# Altium schematic sheet DATN.SchDoc: IOT kit
size A3 portrait; Author: linhcopper@gmail.com
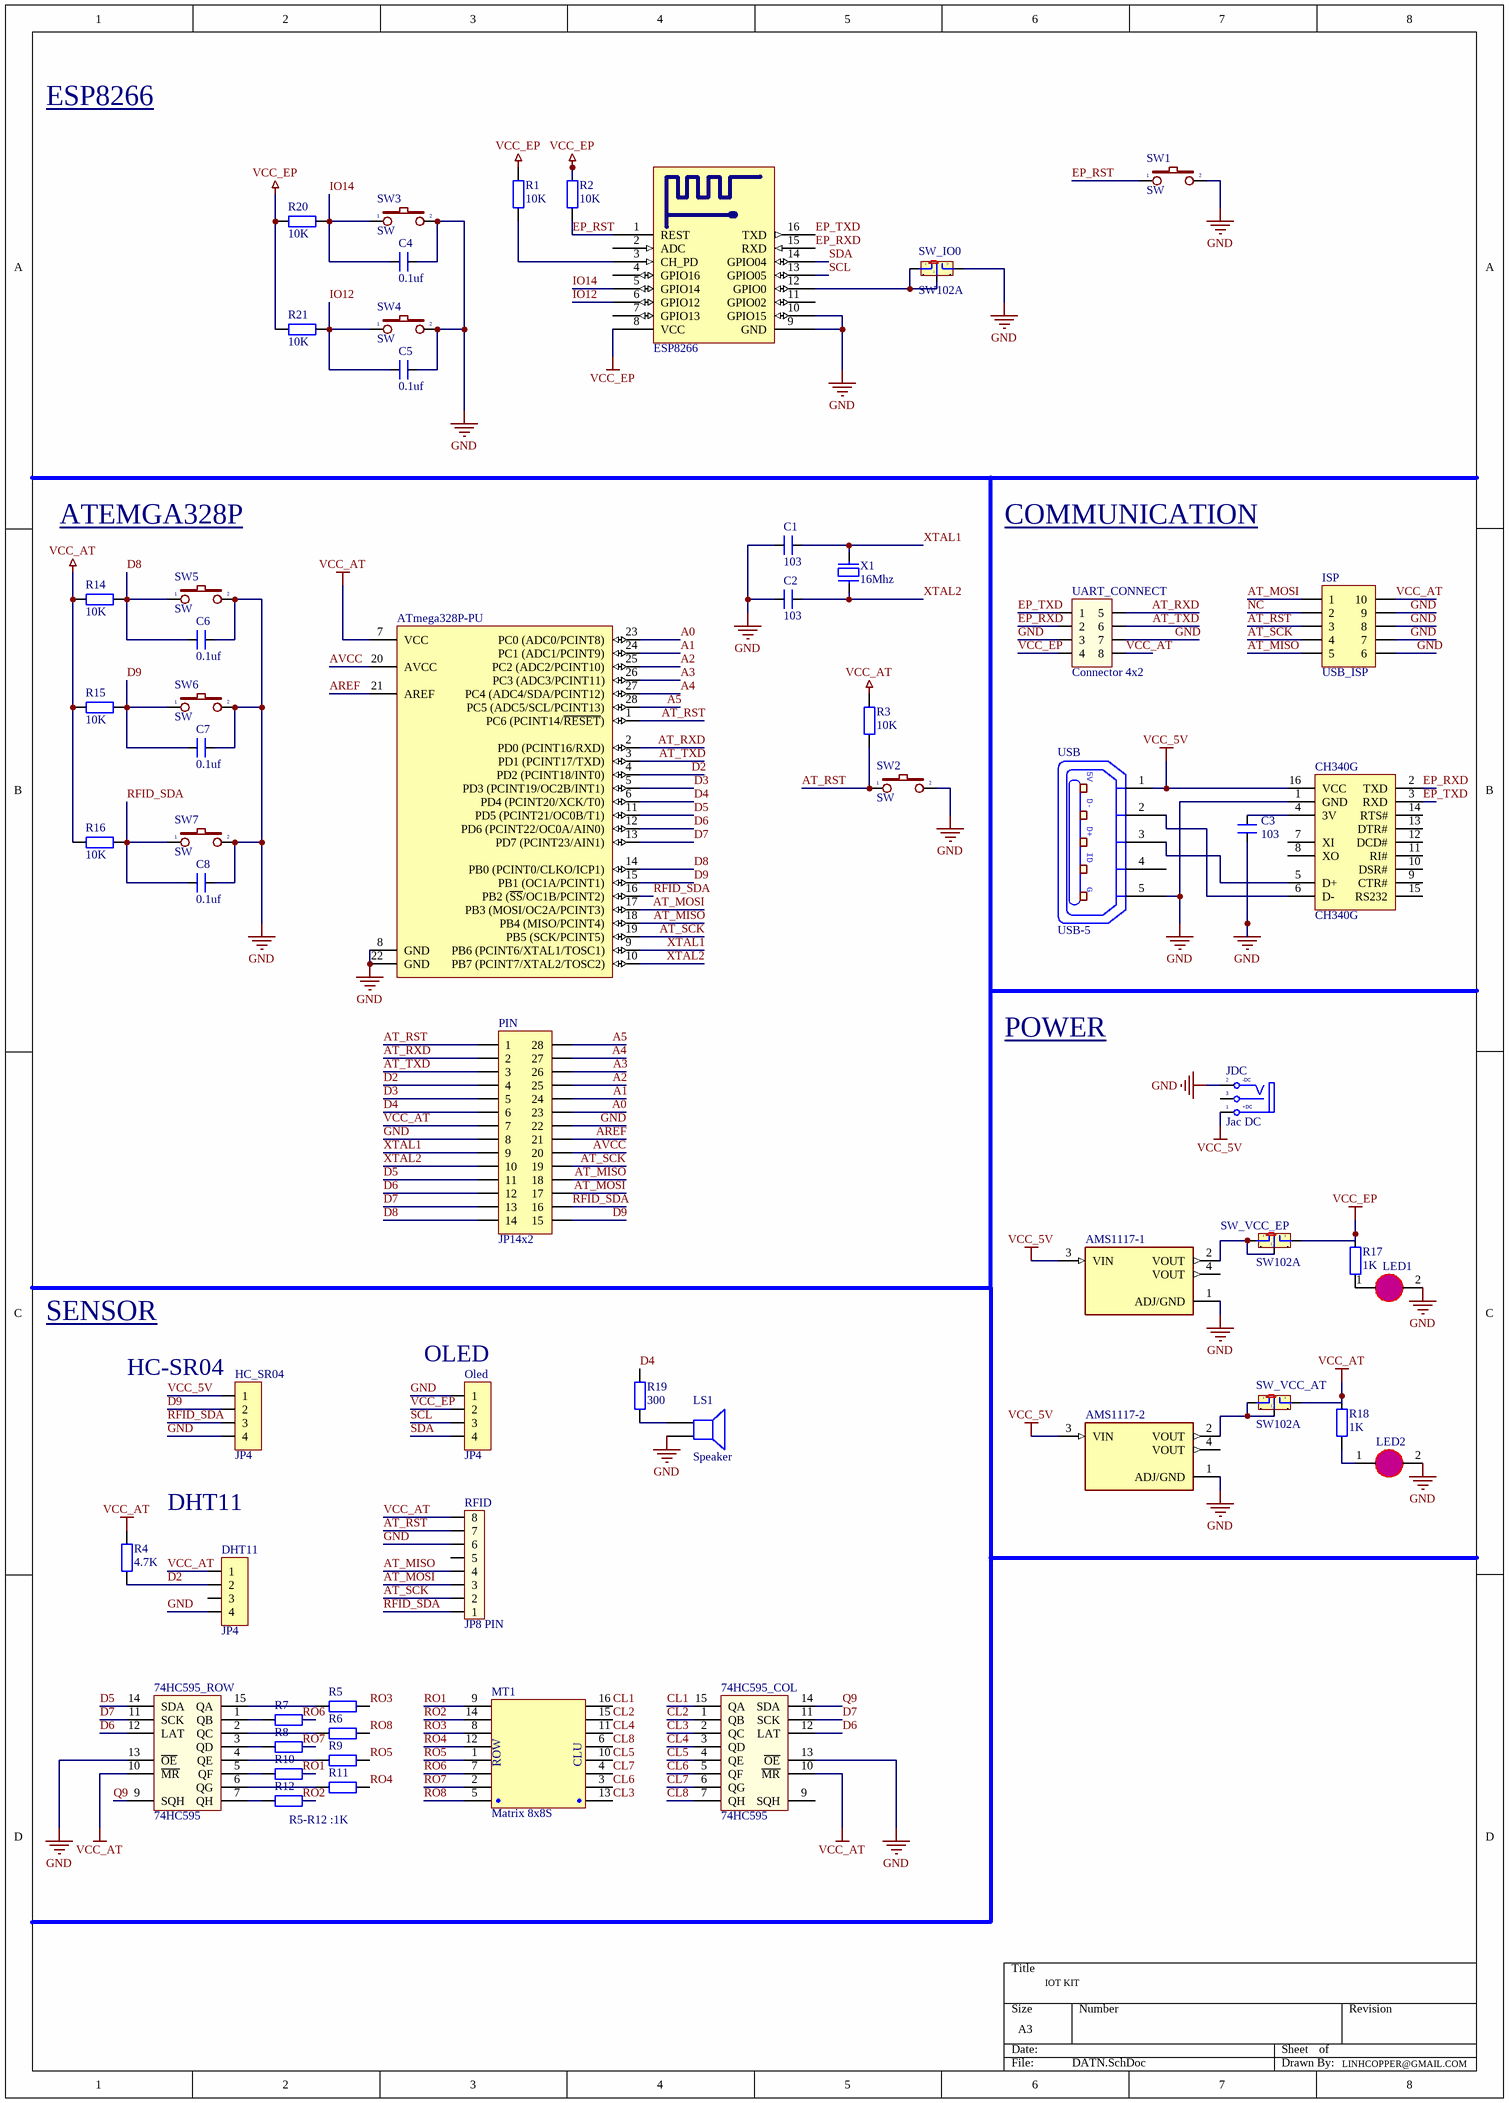
[diagram p0: DATN.SchDoc]

## Parts
74HC595_COL  74HC595  [DIP16/W0.3]
74HC595_ROW  74HC595  [DIP16/W0.3]
AMS1117-1  (no value)  [SOT229P700X180-4N]
AMS1117-2  (no value)  [SOT229P700X180-4N]
ATmega328P-PU  (no value)  [28P3]
C1  103  [SM-0805]
C2  103  [SM-0805]
C3  103  [SM-0805]
C4  0.1uf  [SM-0805]
C5  0.1uf  [SM-0805]
C6  0.1uf  [SM-0805]
C7  0.1uf  [SM-0805]
C8  0.1uf  [SM-0805]
CH340G  CH340G  [SO16]
DHT11  JP4  [JP4 - DHT11]
ESP8266  ESP-12  [ESP_12]  (value not drawn)
HC_SR04  JP4  [JP4 -HC_SR04]
ISP  USB_ISP  [JP5-D2T]
JDC  Jac DC  [DC-IN]
LED1  (no value)  [LED0805]
LED2  (no value)  [LED0805]
LS1  Speaker  [SPEAKER]
MT1  Matrix 8x8S  [8x8S]
Oled  JP4  [JP4]
PIN  JP14x2  [JP14-C2T]
R1  10K  [SM-0805]
R2  10K  [SM-0805]
R3  10K  [SM-0805]
R4  4.7K  [SM-0805]
R5  (no value)  [SM-0805]
R6  (no value)  [SM-0805]
R7  (no value)  [SM-0805]
R8  (no value)  [SM-0805]
R9  (no value)  [SM-0805]
R10  (no value)  [SM-0805]
R11  (no value)  [SM-0805]
R12  (no value)  [SM-0805]
R14  10K  [SM-0805]
R15  10K  [SM-0805]
R16  10K  [SM-0805]
R17  1K  [SM-0805]
R18  1K  [SM-0805]
R19  300  [SM-0805]
R20  10K  [SM-0805]
R21  10K  [SM-0805]
RFID  JP8 PIN  [JP8 -RFIDv2]
SW1  SW  [SW2]
SW2  SW  [SW2]
SW3  SW  [SW2]
SW4  SW  [SW2]
SW5  SW  [SW2]
SW6  SW  [SW2]
SW7  SW  [SW2]
SW_IO0  SW102A  [SW102]
SW_VCC_AT  SW102A  [SW102]
SW_VCC_EP  SW102A  [SW102]
UART_CONNECT  Connector 4x2  [JP4x2]
USB  USB-5  [USB-M1]
X1  16Mhz  [XT2]

## Nets
GND: 74HC595_COL.8(GND) 74HC595_COL.13(~{OE}) 74HC595_ROW.8(GND) 74HC595_ROW.13(~{OE}) AMS1117-1.1(ADJ/GND) AMS1117-2.1(ADJ/GND) ATmega328P-PU.8(GND) ATmega328P-PU.22(GND) C1.1 C2.1 C3.1 C4.2 C5.2 C6.2 C7.2 C8.2 CH340G.1(GND) DHT11.4 ESP8266.9(GND) ESP8266.10(GPIO15) HC_SR04.4 ISP.6 ISP.7 ISP.8 ISP.9 JDC.2(TN) LED1.2(K) LED2.2(K) LS1.2 Oled.1 PIN.8 PIN.22 RFID.6 SW1.2 SW2.2 SW3.2 SW4.2 SW5.2 SW6.2 SW7.2 SW_IO0.3 UART_CONNECT.3 UART_CONNECT.7 USB.5(P5)
VCC: 74HC595_COL.16(VCC) 74HC595_ROW.16(VCC)
VCC_5V: AMS1117-1.3(VIN) AMS1117-2.3(VIN) CH340G.16(VCC) HC_SR04.1 JDC.1(T) USB.1(P1)
VCC_AT: 74HC595_COL.10(~{MR}) 74HC595_ROW.10(~{MR}) ATmega328P-PU.7(VCC) DHT11.1 ISP.10 PIN.7 R3.1 R4.2 R14.2 R15.2 R16.2 R18.2 RFID.8 SW_VCC_AT.3 UART_CONNECT.8
VCC_EP: ESP8266.8(VCC) Oled.2 R1.2 R2.2 R17.2 R20.2 R21.2 SW_VCC_EP.3 UART_CONNECT.4
A0: ATmega328P-PU.23(PC0_(ADC0/PCINT8)) PIN.23
A1: ATmega328P-PU.24(PC1_(ADC1/PCINT9)) PIN.24
A2: ATmega328P-PU.25(PC2_(ADC2/PCINT10)) PIN.25
A3: ATmega328P-PU.26(PC3_(ADC3/PCINT11)) PIN.26
A4: ATmega328P-PU.27(PC4_(ADC4/SDA/PCINT12)) PIN.27
A5: ATmega328P-PU.28(PC5_(ADC5/SCL/PCINT13)) PIN.28
AREF: ATmega328P-PU.21(AREF) PIN.21
AT_MISO: ATmega328P-PU.18(PB4_(MISO/PCINT4)) ISP.5 PIN.18 RFID.4
AT_MOSI: ATmega328P-PU.17(PB3_(MOSI/OC2A/PCINT3)) ISP.1 PIN.17 RFID.3
AT_RST: ATmega328P-PU.1(PC6_(PCINT14/~{RESET})) ISP.3 PIN.1 R3.2 RFID.7 SW2.1
AT_RXD: ATmega328P-PU.2(PD0_(PCINT16/RXD)) PIN.2 UART_CONNECT.5
AT_SCK: ATmega328P-PU.19(PB5_(SCK/PCINT5)) ISP.4 PIN.19 RFID.2
AT_TXD: ATmega328P-PU.3(PD1_(PCINT17/TXD)) PIN.3 UART_CONNECT.6
AVCC: ATmega328P-PU.20(AVCC) PIN.20
CL1: 74HC595_COL.15(QA) MT1.16(C8)
CL2: 74HC595_COL.1(QB) MT1.15(C7)
CL3: 74HC595_COL.2(QC) MT1.13(C1)
CL4: 74HC595_COL.3(QD) MT1.11(C6)
CL5: 74HC595_COL.4(QE) MT1.10(C4)
CL6: 74HC595_COL.5(QF) MT1.3(C2)
CL7: 74HC595_COL.6(QG) MT1.4(C3)
CL8: 74HC595_COL.7(QH) MT1.6(C5)
D2: ATmega328P-PU.4(PD2_(PCINT18/INT0)) DHT11.2 PIN.4 R4.1
D3: ATmega328P-PU.5(PD3_(PCINT19/OC2B/INT1)) PIN.5
D4: ATmega328P-PU.6(PD4_(PCINT20/XCK/T0)) PIN.6 R19.1
D5: 74HC595_ROW.14(SDA) ATmega328P-PU.11(PD5_(PCINT21/OC0B/T1)) PIN.11
D6: 74HC595_COL.12(LAT) 74HC595_ROW.12(LAT) ATmega328P-PU.12(PD6_(PCINT22/OC0A/AIN0)) PIN.12
D7: 74HC595_COL.11(SCK) 74HC595_ROW.11(SCK) ATmega328P-PU.13(PD7_(PCINT23/AIN1)) PIN.13
D8: ATmega328P-PU.14(PB0_(PCINT0/CLKO/ICP1)) C6.1 PIN.14 R14.1 SW5.1
D9: ATmega328P-PU.15(PB1_(OC1A/PCINT1)) C7.1 HC_SR04.2 PIN.15 R15.1 SW6.1
EP_RST: ESP8266.1(REST) R2.1 SW1.1
EP_RXD: CH340G.2(TXD) ESP8266.15(RXD) UART_CONNECT.2
EP_TXD: CH340G.3(RXD) ESP8266.16(TXD) UART_CONNECT.1
IO12: C5.1 ESP8266.6(GPIO12) R21.1 SW4.1
IO14: C4.1 ESP8266.5(GPIO14) R20.1 SW3.1
NC: ISP.2
Q9: 74HC595_COL.14(SDA) 74HC595_ROW.9(SQH)
RFID_SDA: ATmega328P-PU.16(PB2_(~{SS}/OC1B/PCINT2)) C8.1 HC_SR04.3 PIN.16 R16.1 RFID.1 SW7.1
RO1: MT1.9(H8) R10.2
RO2: MT1.14(H7) R12.2
RO3: MT1.8(H6) R5.2
RO4: MT1.12(H5) R11.2
RO5: MT1.1(H4) R9.2
RO6: MT1.7(H3) R7.2
RO7: MT1.2(H2) R8.2
RO8: MT1.5(H1) R6.2
SCL: ESP8266.13(GPIO05) Oled.3
SDA: ESP8266.14(GPIO04) Oled.4
XTAL1: ATmega328P-PU.9(PB6_(PCINT6/XTAL1/TOSC1)) C1.2 PIN.9 X1.1
XTAL2: ATmega328P-PU.10(PB7_(PCINT7/XTAL2/TOSC2)) C2.2 PIN.10 X1.2
Net74HC595_ROW_1: 74HC595_ROW.1(QB) R7.1
Net74HC595_ROW_2: 74HC595_ROW.2(QC) R6.1
Net74HC595_ROW_3: 74HC595_ROW.3(QD) R8.1
Net74HC595_ROW_4: 74HC595_ROW.4(QE) R9.1
Net74HC595_ROW_5: 74HC595_ROW.5(QF) R10.1
Net74HC595_ROW_6: 74HC595_ROW.6(QG) R11.1
Net74HC595_ROW_7: 74HC595_ROW.7(QH) R12.1
Net74HC595_ROW_15: 74HC595_ROW.15(QA) R5.1
NetAMS1117-1_2: AMS1117-1.2(VOUT) SW_VCC_EP.1 SW_VCC_EP.2
NetAMS1117-2_2: AMS1117-2.2(VOUT) SW_VCC_AT.1 SW_VCC_AT.2
NetC3_2: C3.2 CH340G.4(3V)
NetCH340G_5: CH340G.5(D+) USB.3(P3)
NetCH340G_6: CH340G.6(D-) USB.2(P2)
NetESP8266_3: ESP8266.3(CH_PD) R1.1
NetESP8266_12: ESP8266.12(GPIO0) SW_IO0.1 SW_IO0.2
NetLED1_1: LED1.1(A) R17.1
NetLED2_1: LED2.1(A) R18.1
NetLS1_1: LS1.1 R19.2

Not connected (* = marked no-connect by the designer): 74HC595_COL 9(SQH); AMS1117-1 4(VOUT); AMS1117-2 4(VOUT); CH340G 7(XI) 8(XO) 9(CTR#) 10(DSR#) 11(RI#) 12(DCD#) 13(DTR#) 14(RTS#) 15(RS232); DHT11 3; ESP8266 2(ADC) 4(GPIO16) 7(GPIO13) 11(GPIO02); JDC 3(S); RFID 5; SW_IO0 4 5; SW_VCC_AT 4 5; SW_VCC_EP 4 5; USB 4(P4)

## Notes on the sheet
- ESP8266
- ATEMGA328P
- COMMUNICATION
- POWER
- SENSOR
- (near HC_SR04) HC-SR04
- (near Oled) OLED
- DHT11
- (near R12) R5-R12 :1K
- IOT KIT
- LINHCOPPER@GMAIL.COM
- (in symbol DCIN) -DC; +DC
- (in symbol LED 8x8S) ROW; CLU
- (in symbol USB-5) 5V; D-; D+; ID; G

## Library data of the parts
74HC595_COL 74HC595_ROW = 74595: 8 Bit Serial input - Parallel Output; Value: 74HC595
AMS1117-1 AMS1117-2 = AMS1117: UNO PLUS Arduino R3 Shield, Xbee Arduino IDE Wheeled Robotics Kit; MF: Seeed Technology; Availability: Unavailable; SnapEDA_Link: https://www.snapeda.com/parts/AMS1117/Seeed%20Technology%20Co.%2C%20Ltd/view-part/184428/?ref=snap; MP: AMS1117; Price: None; Value: *; Package: SOT-223 Seeed Technology
ATmega328P-PU = ATmega328P-PU: 8-bit AVR Microcontroller, 32KB Flash, 1KB EEPROM, 2KB SRAM, 28-pin PDIP, Industrial Grade (-40°C to 85°C); Published: 1-Apr-2010; DatasheetVersion: revA, Jan-2010; PackageVersion: revB, Sep-2001; PackageReference: 28P3; Publisher: Altium Limited; PackageDescription: 28-lead (0.300"/7.62mm Wide) Plastic Dual Inline Package (PDIP); Supplier 1: Digi-Key; Supplier Part Number 1: ATMEGA328P-PU-ND; Supplier 2: Farnell; Supplier Part Number 2: 1715487; Supplier 3: Mouser; Supplier Part Number 3: 556-ATMEGA328P-PU; ComponentLink1Description: Manufacturer Link; ComponentLink1URL: http://www.atmel.com/products/avr/default.asp?; ComponentLink2Description: ATmega48A/48PA/88A/88PA/168A/168PA/328/328P Datasheet; ComponentLink2URL: http://www.atmel.com/dyn/resources/prod_documents/8271.pdf; ComponentLink3Description: ATmega48A/48PA/88A/88PA/168A/168PA/328/328P Summary; ComponentLink3URL: http://www.atmel.com/dyn/resources/prod_documents/8271S.pdf; ComponentLink4Description: Atmel.com Home; ComponentLink4URL: http://www.atmel.com
C1-C3 = CM: Cap SMD; Value: 103
C4-C8 = CM: Cap SMD; Value: 103
CH340G = CH340G: High and Low Side Driver; Note: Pins 4, 8 and 14 are not connected; Published: 8-Jun-2000; LatestRevisionDate: 04-Mar-2005; LatestRevisionNote: Stylized 3D Model Added.; DatasheetVersion: PD60147J; PackageReference: PDIP14; Publisher: Altium Limited; PackageDescription: DIP; 14 Leads; Row Spacing 7.62 mm; Pitch 2.54 mm; ComponentLink1Description: Manufacturer Link; ComponentLink1URL: http://www.irf.com/; ComponentLink2Description: Datasheet; ComponentLink2URL: http://www.irf.com/product-info/datasheets/data/ir2110.pdf
DHT11 HC_SR04 Oled = JP4: WR-PHD 2.54 mm Angled Socket Header; Manufacturer: W¨¹rth Elektronik eiSos GmbH; partNo: 613004143121; ComponentLink1 Description: Manufacturer; ComponentLink2 Description: Datasheet; NoPins: 04; Created Date: 29 March 2013; ComponentLink1URL: http://www.we-online.com; ComponentLink2URL: http://katalog.we-online.de/em/datasheet/6130xx143121.pdf; Created by: Karrer Zheng
ISP = JP5x2: WR-PHD 2.54 mm Dual Socket Header; Manufacturer: W¨¹rth Elektronik eiSos GmbH; partNo: 61301021821; ComponentLink1 Description: Manufacturer; ComponentLink2 Description: Datasheet; NoPins: 10; Created Date: 29 March 2013; ComponentLink1URL: http://www.we-online.com; ComponentLink2URL: http://katalog.we-online.de/em/datasheet/6130xx21821.pdf; Created by: Karrer Zheng
JDC = DCIN: Jac DC input; Value: Jac DC
LED1 LED2 = LED0805: LED SMD 0805
LS1 = Speaker: Loudspeaker; Published: 24-Mar-1999; LatestRevisionDate: 17-Jul-2002; LatestRevisionNote: Re-released for DXP Platform.; PackageReference: PIN2; Publisher: Altium Limited
MT1 = LED 8x8S: Matrix 8x8,  Single colour; Value: Matrix 8x8S
PIN = JP14x2: WR-PHD 2.54 mm Dual Socket Header; Manufacturer: W¨¹rth Elektronik eiSos GmbH; partNo: 61302821821; ComponentLink1 Description: Manufacturer; ComponentLink2 Description: Datasheet; NoPins: 28; Created Date: 29 March 2013; ComponentLink1URL: http://www.we-online.com; ComponentLink2URL: http://katalog.we-online.de/em/datasheet/6130xx21821.pdf; Created by: Karrer Zheng
R1-R12 R14-R16 R19-R21 = RM: Resistor SMD; Value: 1K
R17 R18 = RM: Resistor SMD; Value: 1K
RFID = JP8: Value: JP7
SW1-SW7 = SW2: Switch button 2 pin; Value: SW chip 2 pin
SW_IO0 SW_VCC_AT SW_VCC_EP = SW102A: Switch 102 on Broad; Value: Switch 102 On Board
UART_CONNECT = JP4x2: Value: Connector 4x2
USB = USB-5: Manufacturer: FCI; Manufacturer Part Number: 10118193-0001LF; Connector Type: USB - micro B; Number of Contacts: 5; Gender: Receptacle; Specifications: USB 2.0; .Creator: MM; .Checked PCB: RF; Supplier 1: Digi-Key; RoHS: RoHS Compliant; Category: Connectors, Interconnects; Stock 1: 28642; Pricing 1: 1=0.46, 10=0.433, 25=0.3712, 50=0.3156, 100=0.3032, 250=0.27224, 500=0.25988 (USD); Packaging: Cut Tape (CT); Mounting Type: Surface Mount, Right Angle, Horizontal; Features: Shielded, Solder Retention; Ingress Protection: -; ComponentLink1URL: http://portal.fciconnect.com/Comergent//fci/drawing/10118193.pdf; ComponentLink1Description: http://portal.fciconnect.com/Comergent//fci/drawing/10118193.pdf; Supplier Part Number 1: 609-4616-1-ND; .Checked SCH: MM
X1 = XT2: Crystal For all Crystal 2pin.; Value: 4Mhz